# EAGLE design xbee module (EAGLE 5.03)
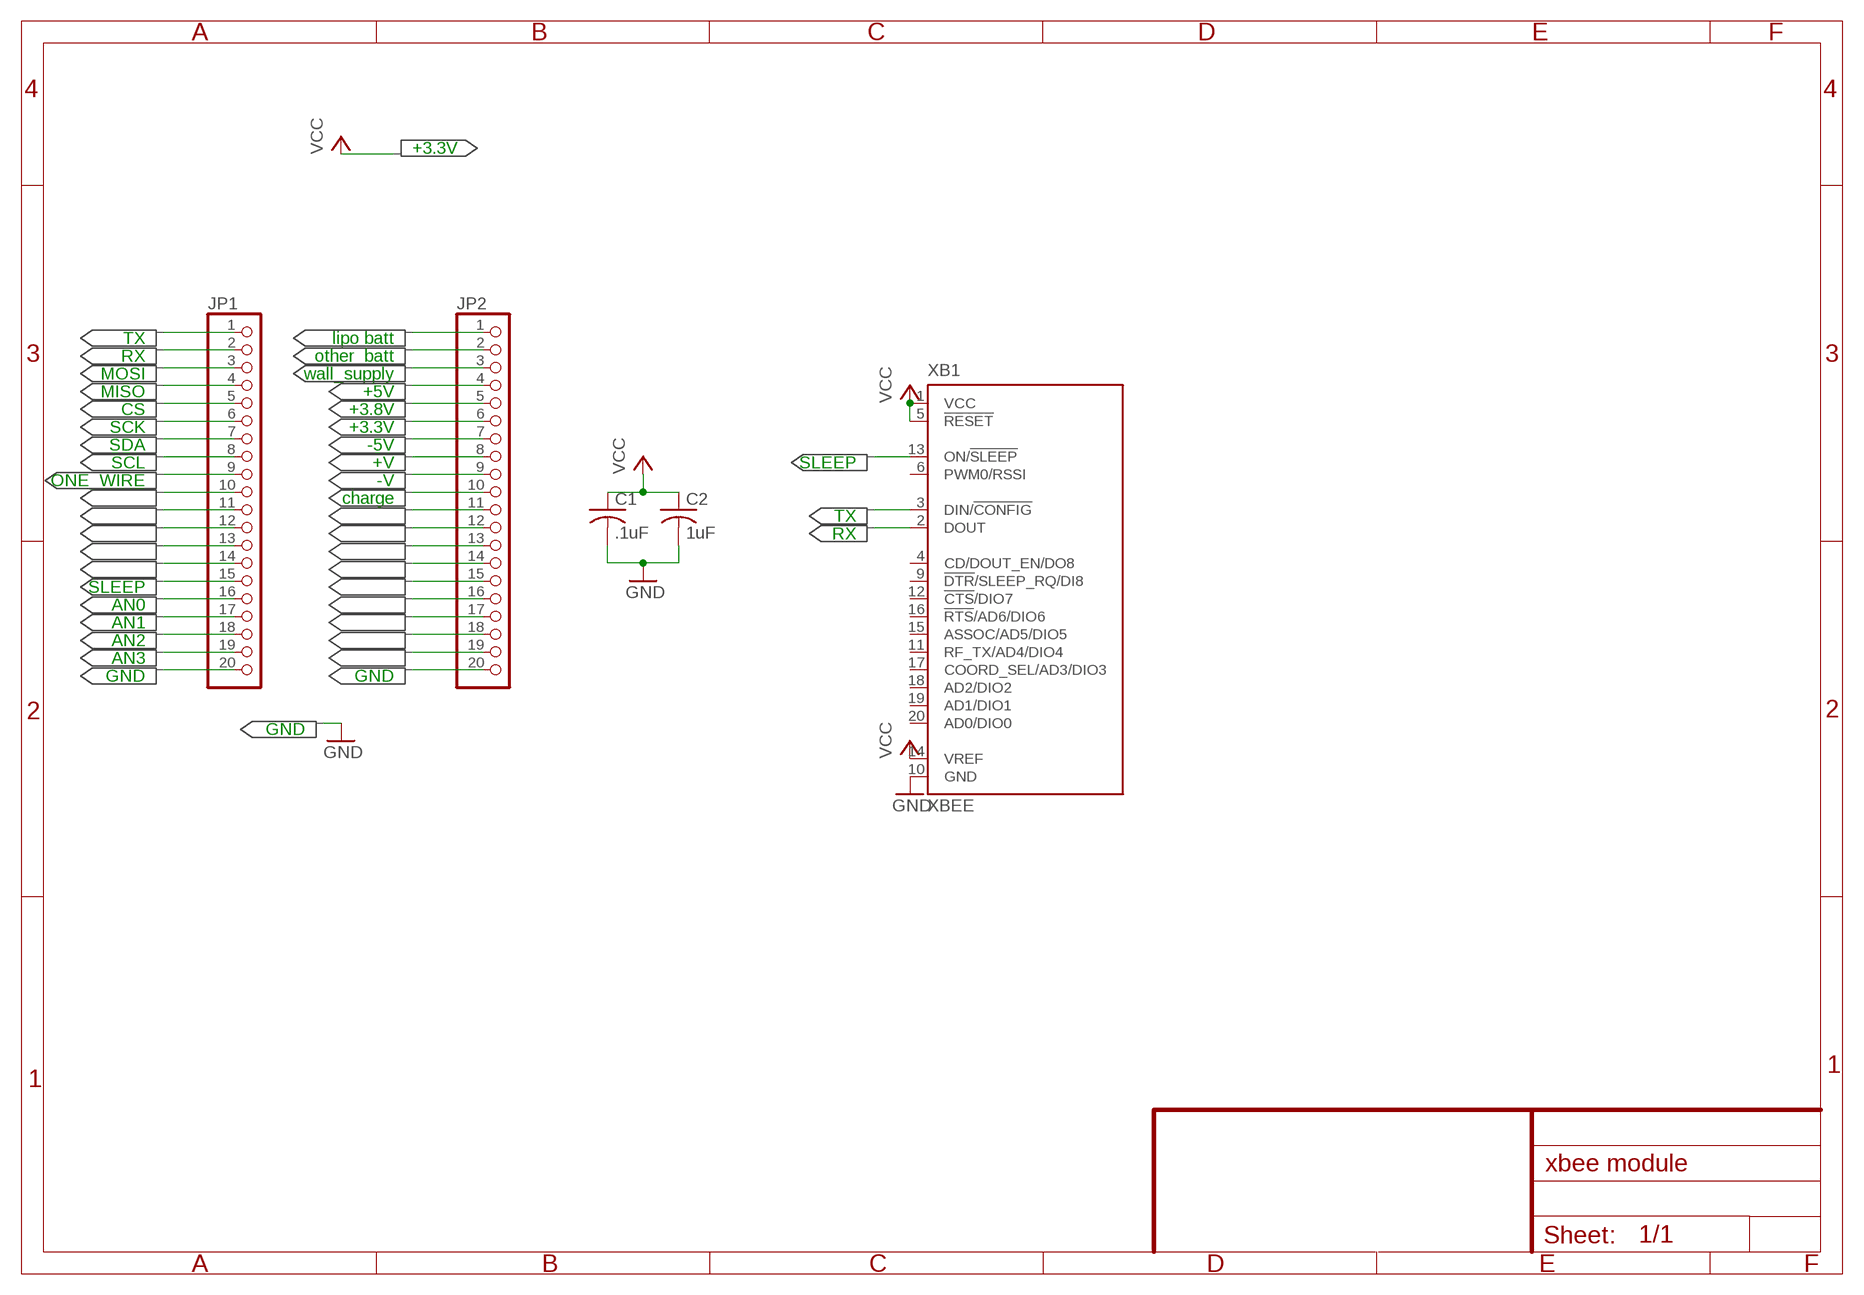
[diagram p0: schematic, sheet 1]

## Parts
C1  .1uF  C-USC0603  [C0603]
C2  1uF  C-USC0603  [C0603]
JP1  PINHD-1X20  [1X20]
JP2  PINHD-1X20  [1X20]
XB1  XBEE  [XBEE]

## Nets
+3.3V: JP2.6
+5V: JP2.4
+V: JP2.8
-5V: JP2.7
-V: JP2.9
ALARM: JP1.14
AN0: JP1.16
AN1: JP1.17
AN2: JP1.18
AN3: JP1.19
CD: JP1.10
CHARGE: JP2.10
CS: JP1.5
GND: C1.2 C2.2 JP1.20 JP2.20 XB1.10(GND)
LIPO_BATT: JP2.1
LOG: JP1.12
MISO: JP1.4
MOSI: JP1.3
N$1: JP2.11
N$6: JP2.12
N$7: JP2.13
N$11: JP2.14
N$12: JP2.15
N$13: JP2.16
N$14: JP2.17
N$15: JP2.18
N$16: JP2.19
ONE_WIRE: JP1.9
OTHER_BATT: JP2.2
RIN: JP1.13
RX: JP1.2 XB1.2(DOUT)
SCK: JP1.6
SCL: JP1.8
SDA: JP1.7
SLEEP: JP1.15 XB1.13(ON/!SLEEP)
SW: JP1.11
TX: JP1.1 XB1.3(DIN/!CONFIG)
VCC: C1.1 C2.1 JP2.5 XB1.1(VCC) XB1.5(!RESET) XB1.14(VREF)
WALL_SUPPLY: JP2.3
Unconnected: XB1.4(CD/DOUT_EN/DO8) XB1.6(PWM0/RSSI) XB1.9(!DTR!/SLEEP_RQ/DI8) XB1.11(RF_TX/AD4/DIO4) XB1.12(!CTS!/DIO7) XB1.15(ASSOC/AD5/DIO5) XB1.16(!RTS!/AD6/DIO6) XB1.17(COORD_SEL/AD3/DIO3) XB1.18(AD2/DIO2) XB1.19(AD1/DIO1) XB1.20(AD0/DIO0)

## Notes on the sheet
- +3.3V
- TX | lipo batt
- RX | other_batt
- MOSI | wall_supply
- MISO | +5V
- CS | +3.8V
- SCK | +3.3V
- SDA | -5V
- SCL | +V | SLEEP
- ONE_WIRE | -V
- charge
- TX
- RX
- SLEEP
- AN0
- AN1
- AN2
- AN3
- GND | GND
- GND

## Library data of the parts
C1 C2 = rcl:C-US: CAPACITOR, American symbol
JP1 JP2 = pinhead:PINHD-1X20: PIN HEADER
XB1 = maxstream:XBEE: XBee (TM) /XBee-PRO(TM) OEM RF Modules Source: MaxStream, Inc. xbee_productmanual.pdf

## Board
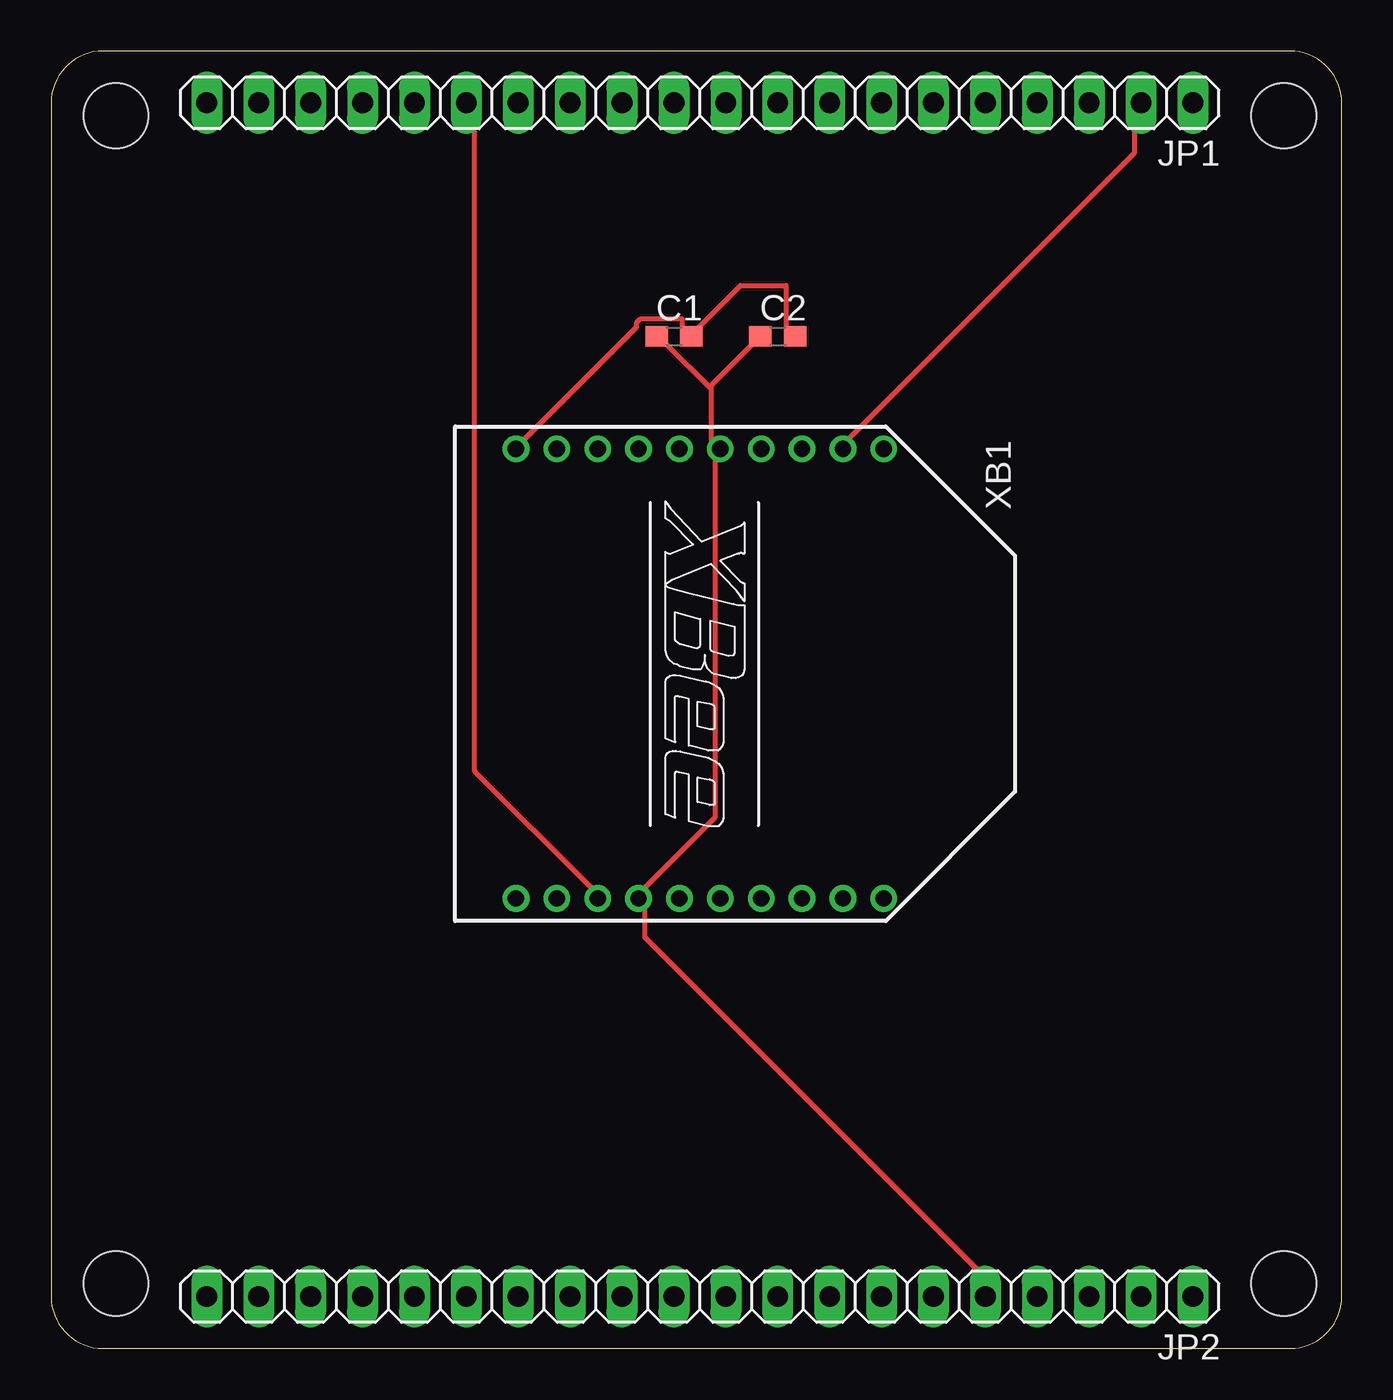
[diagram p1: board, top side]
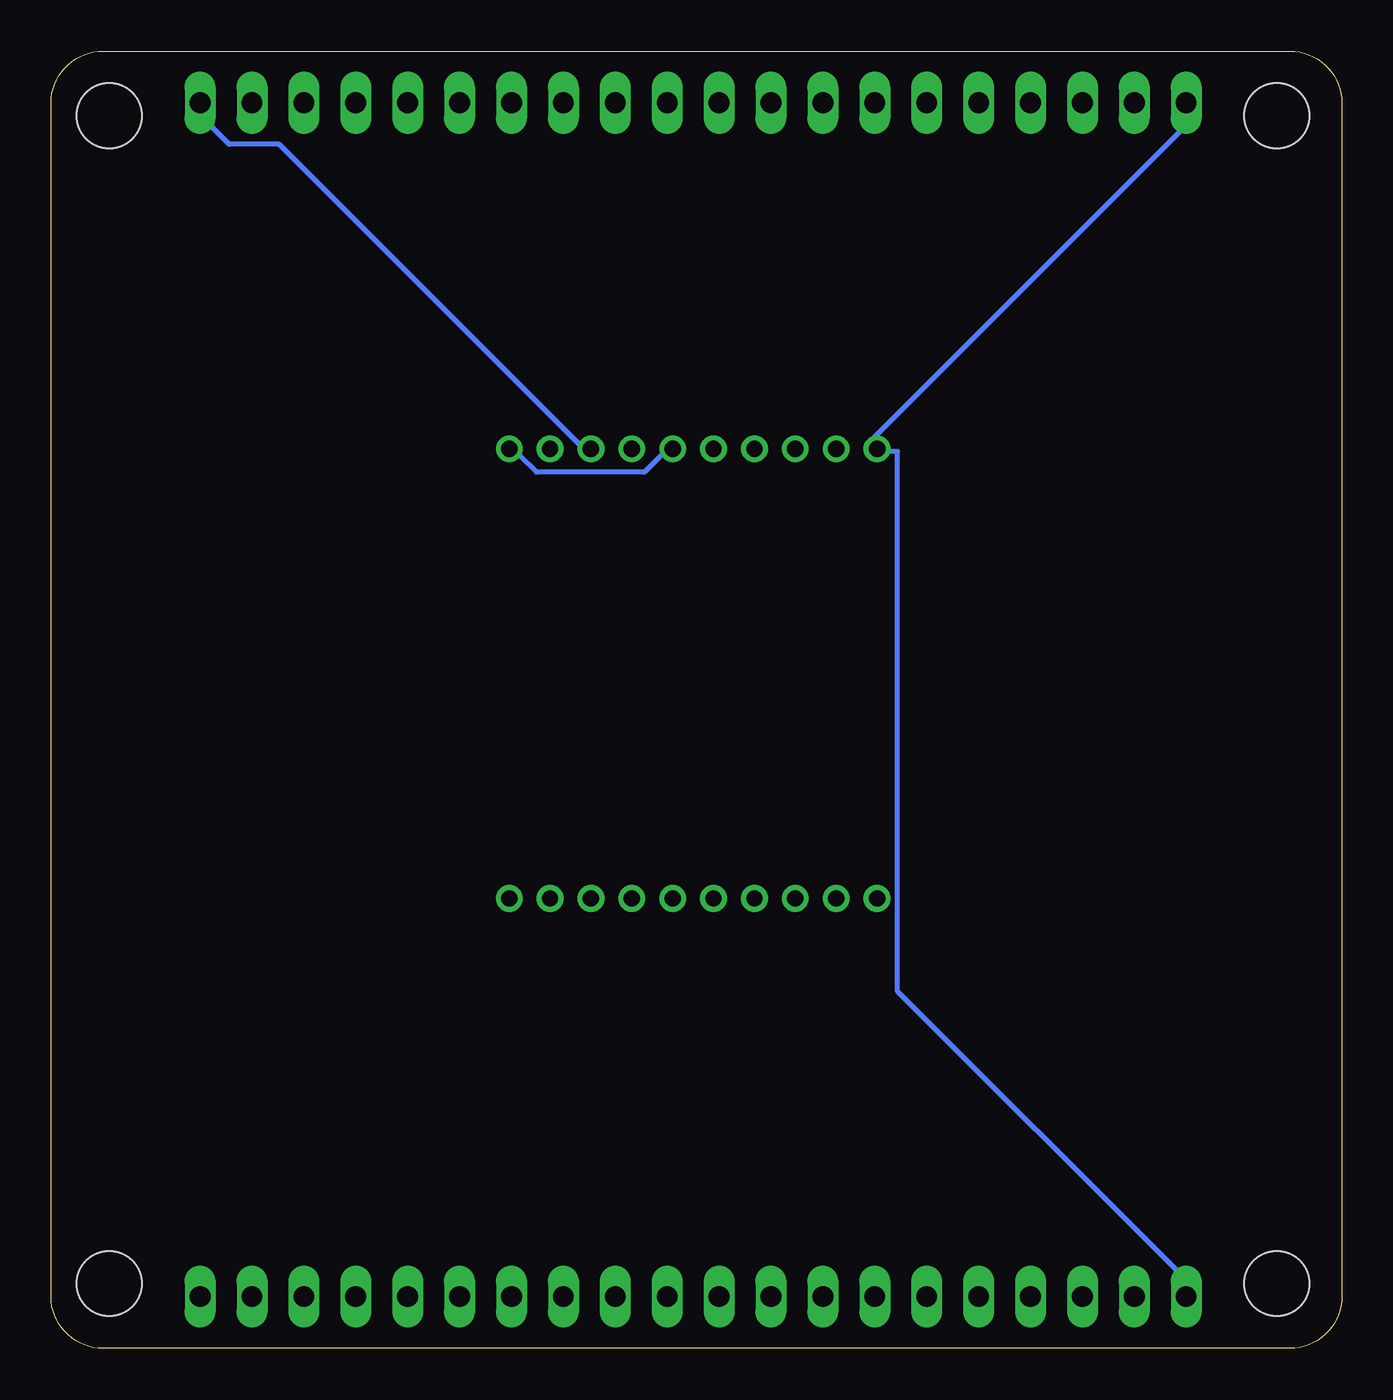
[diagram p2: board, bottom side, seen from below]

Size 63.17 x 63.49 mm. Coordinates in mm from the lower left corner, seen from the top.
Outline: 60.63,0 arc90 63.17,2.54 63.17,60.95 arc90 60.63,63.49 2.54,63.49 arc90 0,60.95 0,2.54 arc90 2.54,0 60.63,0
Copper layers (1*16): Top 0.035mm / dielectric 1.5mm / Bottom 0.035mm
Design rules "default": minimum track width 10mil, minimum drill 24mil, track to track 8mil, track to pad 8mil, pad to pad 8mil, via to via 8mil, smd to smd 8mil, copper to edge 40mil, drill to drill 8mil, minimum pad ring 10mil, minimum via ring 8mil, stop-mask expansion 4mil, vias tented up to drill 0mil, thermal gap 10mil
Holes 3.17 mm at 3.17,3.17 60.33,3.17 60.33,60.33 3.17,60.33

### Footprints (pad centres in the part's own frame; a part is rotated, then mirrored left to right if it is on the bottom)
C0603 = smd 1.1 x 1: 1 -0.85,0; 2 0.85,0
1X20 = drill 1.016 long: 1 -24.13,0; 2 -21.59,0; 3 -19.05,0; 4 -16.51,0; 5 -13.97,0; 6 -11.43,0; 7 -8.89,0; 8 -6.35,0; 9 -3.81,0; 10 -1.27,0; 11 1.27,0; 12 3.81,0; 13 6.35,0; 14 8.89,0; 15 11.43,0; 16 13.97,0; 17 16.51,0; 18 19.05,0; 19 21.59,0; 20 24.13,0
XBEE = drill 0.8 pad 1.27 round: 1 -11,9; 2 -11,7; 3 -11,5; 4 -11,3; 5 -11,1; 6 -11,-1; 7 -11,-3; 8 -11,-5; 9 -11,-7; 10 -11,-9; 11 11,-9; 12 11,-7; 13 11,-5; 14 11,-3; 15 11,-1; 16 11,1; 17 11,3; 18 11,5; 19 11,7; 20 11,9

### Placement (x,y rotation side)
C1  30.48,49.53 0 top
C2  35.56,49.53 0 top
JP1  31.75,60.96 180 top
JP2  31.75,2.54 180 top
XB1  31.75,33.02 270 top

### Tracks (layer width: path | path; a pad name or v marks a point on that pad's centre or on a via)
GND
  Top 0.254: C2.2 35.97,49.99 35.97,52.02 33.73,52.02 31.7,49.99 C1.2 30.89,49.99 30.89,50.39 28.85,50.39 28.65,50.19 28.65,49.99 23.16,44.5 XB1.10
  Bottom 0.254: JP2.20 8.13,3.86 21.74,17.48 21.74,43.89 22.15,43.89 XB1.10 22.96,44.5 7.92,59.54 JP1.20
RX
  Top 0.254: XB1.2 39.01,44.5 53.03,58.52 53.03,59.54 JP1.2
SLEEP
  Top 0.254: XB1.13 26.42,22.55 20.73,28.25 20.73,59.54 JP1.15
TX
  Bottom 0.254: XB1.3 37.39,44.3 52.02,58.93 54.46,58.93 55.27,59.74 JP1.1
VCC
  Top 0.254: 32.31,46.94 30.07,49.17 C1.1 | 32.31,46.94 32.31,44.5 XB1.5 32.51,43.48 32.51,26.01 29.06,22.55 XB1.14 29.06,21.54 29.06,20.12 45.31,3.86 JP2.5 | 32.31,46.94 32.31,47.14 34.34,49.17 C2.1
  Bottom 0.254: XB1.1 40.23,43.69 39.42,42.88 34.14,42.88 33.33,43.69 XB1.5